# EasyEDA Pro project TTMT_ENTIRE_EASYEDA_PROJECT.epro, board PCB3_1
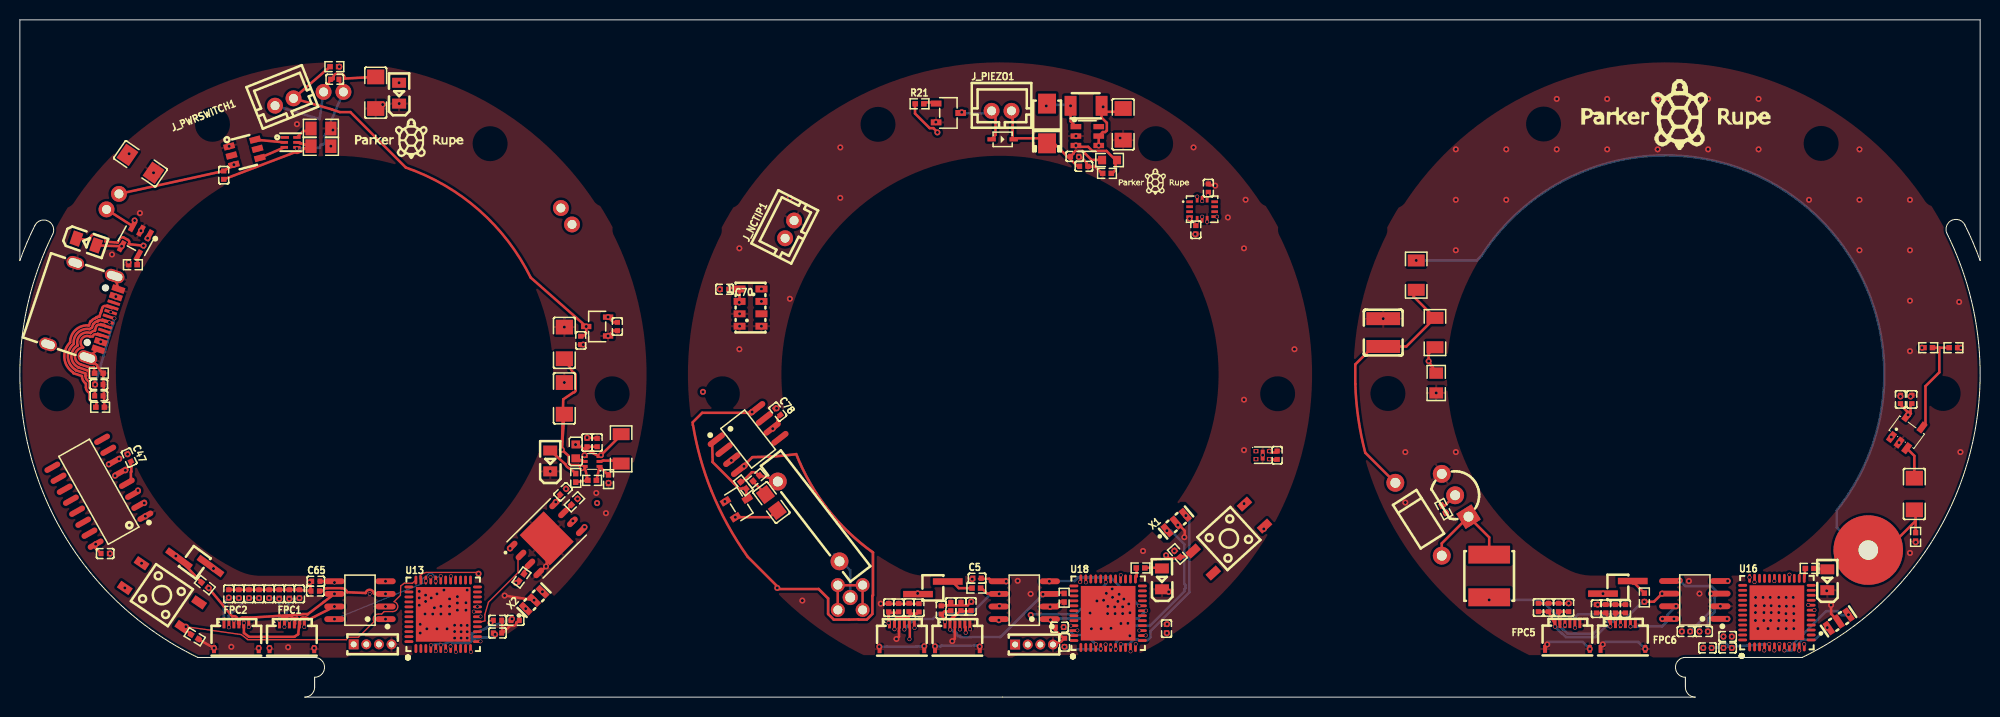
[diagram p18: board, top side]
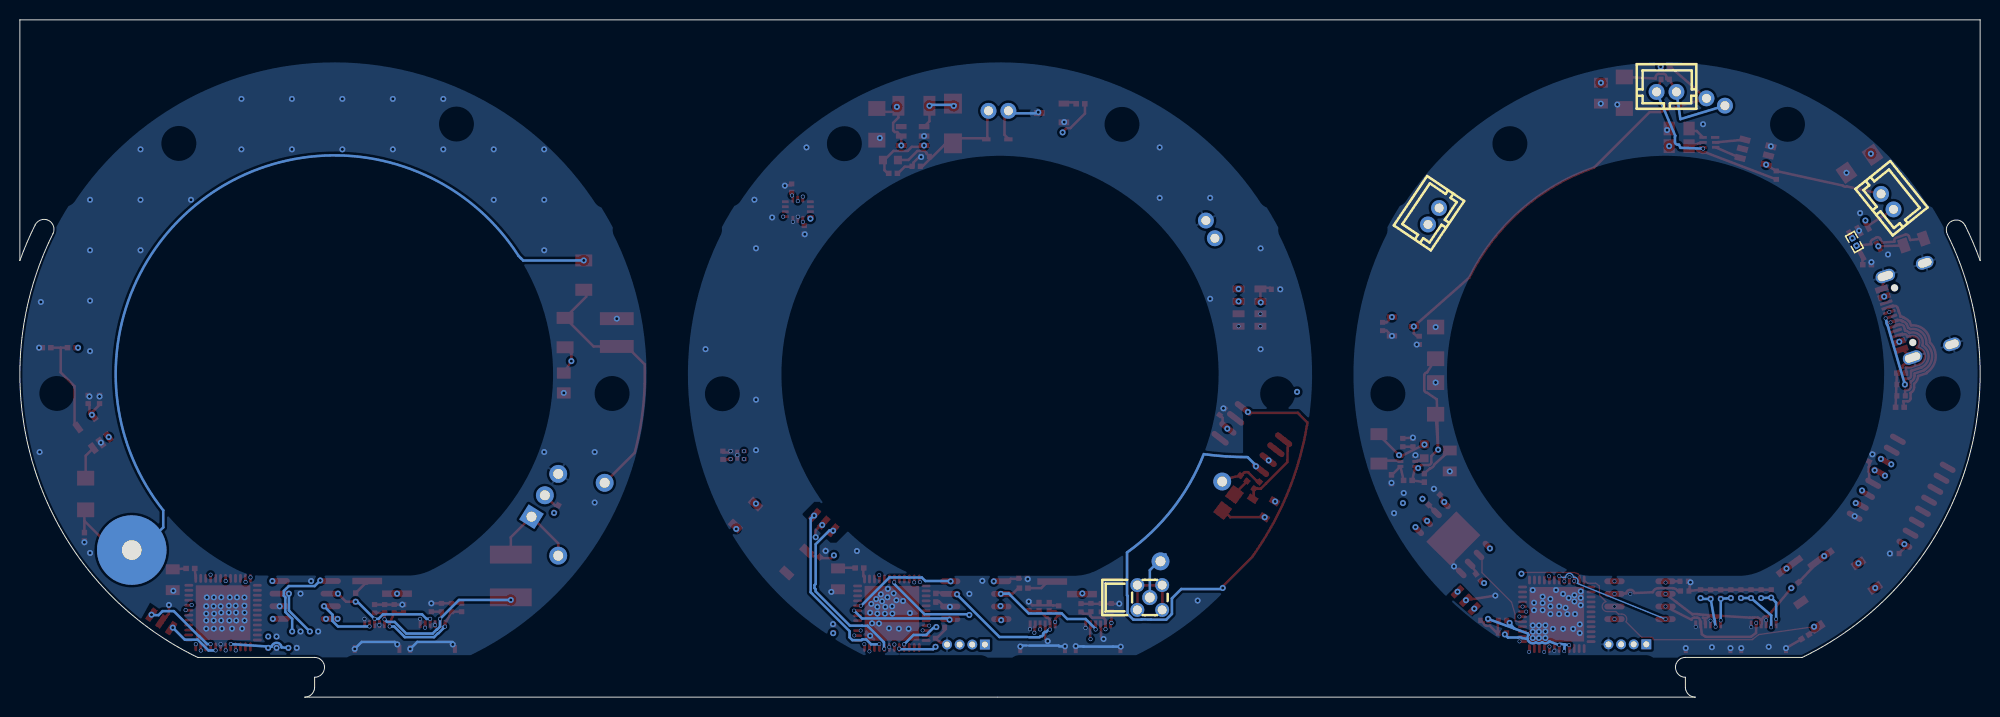
[diagram p19: board, bottom side, seen from below]

Outline 197.34 x 68.2 mm; copper layers: Top Layer, GND, 3V3, Inner3, Inner4, Bottom Layer. Coordinates in mm from the lower left corner of the outline.
Outline path: 0,68.2 197.34,68.2 197.34,43.96 arc(196.63,45.78) 195.81,47.55 arc(194.47,47.99) 194.02,46.65 arc(195.64,22.28) 179.44,4 167.67,4 arc(166.67,3) 167.67,2 167.67,1 arc(167.96,0.29) 168.67,0 28.67,0 arc(29.38,0.29) 29.67,1 29.67,2 arc(30.67,3) 29.67,4 17.91,4 arc(1.71,22.26) 3.3,46.61 arc(2.85,47.95) 1.51,47.5 arc(0.71,45.75) 0,43.96 0,68.2
Stack: Top Layer 0.035mm Outer layer thickness 1oz / Dielectric1 0.0994mm 3313 RC57% 4.2mil / GND 0.0152mm Inner layer thickness / Dielectric2 0.55mm 0.55mm H/H No copper / 3V3 0.0152mm Inner layer thickness / Dielectric3 0.1088mm 2116 RC54% 4.9mil / Inner3 0.0152mm Inner layer thickness / Dielectric4 0.55mm 0.55mm H/H No copper / Inner4 0.0152mm Inner layer thickness / Dielectric5 0.0994mm 3313 RC57% 4.2mil / Bottom Layer 0.035mm Outer layer thickness 1oz

## Design rules (mm)
template: Custom Config
spacing copperThickness1oz (default): track to track 0.102, other pairs 0.1 to 0.3
spacing copperThickness2oz: track to track 0.203, other pairs 0.152 to 0.3
track width copperThickness1oz (default): min 0.127, default 0.254, max 2.54
track width copperThickness2oz: min 0.203, default 0.254, max 2.54
differential pair differentialPair (default): width min 0.127, default 0.254, max 2.54; gap min 0.152, default 0.152
via viaSize (default): diameter min 0.1, default 0.61, max 10; hole min 0.05, default 0.305, max 6.3

## Placement (name value [footprint] x y rotation side)
C1  47uF  [C1111]  137.25 36.71 270 top
C2  100nF  [C1206]  54.81 35.67 270 top
C3  10uF  [C1206]  190.72 20.45 90 top
C4  10uF  [C0805]  75.66 19.6 306.7 top
C5  10uF  [C0402]  96.36 11.97 0 top
C6  10nF  [C0402]  7.95 31.48 180 top
C7  10uF  [C0402]  58.12 25.64 270 top
C8  100nF  [C0402]  90.51 8.99 270 top
C9  10uF  [C0402]  92.76 8.78 270 top
C10  10uF  [C0402]  93.72 9.13 270 top
C11  100nF  [C0402]  94.74 9.13 270 top
C12  100nF  [C0402]  95.76 9.14 90 top
C13  22uF  [C0402]  153.89 9.02 270 top
C14  470pF  [C0402]  154.91 9.02 270 top
C15  100pF  [C0402]  155.92 9.02 90 top
C16  100nF  [C0402]  158.72 8.9 90 top
C17  100nF  [C0402]  159.66 8.9 270 top
C18  100nF  [C0402]  161.64 8.9 270 top
C19  100nF  [C0402]  87.47 9.01 270 top
C20  10uF  [C0402]  88.47 9 90 top
C21  10uF  [C0402]  104.66 7.04 180 top
C22  100nF  [C0402]  105.17 5.51 90 top
C23  10uF  [C0402]  167.73 6.61 0 top
C24  100nF  [C0402]  169.51 6.61 180 top
C25  10uF  [C0402]  169.89 4.96 180 top
C26  100nF  [C0402]  171.92 4.96 180 top
C27  100nF  [C0402]  171.92 6.1 180 top
C38  4.7uF  [C1206]  35.82 60.86 90 top
C39  4.7uF  [C1206]  12.14 53.7 325.5 top
C40  100nF  [C0402]  20.52 52.56 270 top
C43  100nF  [C0402]  48.08 7.73 0 top
C44  100nF  [C0402]  48.08 6.46 0 top
C45  100nF  [C0402]  49.86 7.73 0 top
C46  100nF  [C0402]  152.87 9.02 90 top
C47  100nF  [C0402]  11 24.11 294.8 top
C50  100nF  [C0402]  8.59 14.46 0 top
C51  10nF  [C0402]  7.95 30.33 180 top
C52  100nF  [C0402]  56.47 35.92 90 top
C53  100nF  [C0402]  60.15 37.32 90 top
C54  22uF  [C1206]  111.07 57.68 90 top
C55  22uF  [C1206]  54.81 30.08 270 top
C56  1uF  [C0402]  57.1 25.64 270 top
C57  100nF  [C0402]  25.1 10.4 90 top
C58  100nF  [C0402]  28.15 10.4 90 top
C59  100nF  [C0402]  24.08 10.4 90 top
C60  100nF  [C0402]  21.03 10.4 90 top
C61  10uF  [C0402]  22.05 10.4 270 top
C62  10uF  [C0402]  23.06 10.4 270 top
C63  10uF  [C0402]  27.13 10.4 270 top
C64  10uF  [C0402]  26.11 10.4 270 top
C65  100nF  [C0402]  29.8 11.67 0 top
C66  100nF  [C0402]  29.74 10.68 180 top
C67  100nF  [C0402]  54.69 20.68 224.1 top
C68  100nF  [C0402]  160.62 8.9 90 top
C69  100nF  [C0402]  115.44 6.9 270 top
C70  100nF  [C0402]  70.94 41.07 180 top
C71  100nF  [C0402]  189.32 29.98 270 top
C72  10uF  [C0402]  190.47 29.98 270 top
C73  100nF  [C0402]  118.38 47.06 270 top
C74  100nF  [C0402]  119.65 51.26 90 top
C75  100nF  [C0402]  106.2 54.45 180 top
C76  10uF  [C0402]  107.11 53.45 180 top
C78  100nF  [C0402]  76.31 28.74 307.9 top
C79  100nF  [C0402]  126.57 24.36 270 top
C80  100nF  [C0402]  89.52 9.03 90 top
C_VBAT1  10uF  [C0402]  31.7 62.21 180 top
D1  BAV99  [SOT-23-3_L2.9-W1.3-P1.90-LS2.4-BR]  72.39 19.45 212.2 top
D2  BAV20WS-HE3-08  [SOD-323_L1.8-W1.3-LS2.7-RD]  98.94 56.17 180 top
D3  SS34  [SMA_L4.2-W2.7-LS5.0-RD]  103.41 57.76 90 top
D4  UF4007  [DO-41_BD2.4-L4.7-P8.70-D0.9-RD]  140.81 17.91 302.5 top
FPC1  HC-FPC-05-09-6RLTAG  [FPC-SMD_6P-P0.50_HC-FPC-05-09-6RLTAG]  27.38 6.08 180 top
FPC2  HC-FPC-05-09-6RLTAG  [FPC-SMD_6P-P0.50_HC-FPC-05-09-6RLTAG]  21.79 6.08 180 top
FPC3  HC-FPC-05-09-6RLTAG  [FPC-SMD_6P-P0.50_HC-FPC-05-09-6RLTAG]  88.79 6.08 180 top
FPC4  HC-FPC-05-09-6RLTAG  [FPC-SMD_6P-P0.50_HC-FPC-05-09-6RLTAG]  94.38 6.08 180 top
FPC5  HC-FPC-05-09-6RLTAG  [FPC-SMD_6P-P0.50_HC-FPC-05-09-6RLTAG]  155.79 6.1 180 top
FPC6  HC-FPC-05-09-6RLTAG  [FPC-SMD_6P-P0.50_HC-FPC-05-09-6RLTAG]  161.38 6.1 180 top
H1  M50-3630242  [HDR-SMD_2P-P1.27_M50-3630242]  91.92 11.01 90 top
H2  M50-3630242  [HDR-SMD_2P-P1.27_M50-3630242]  160.88 11.06 90 top
H3  M50-3630242  [HDR-SMD_2P-P1.27_M50-3630242]  17.6 13.57 233.8 top
J_BAT1  B2B-PH-K-S(LF)(SN)  [CONN-TH_B2B-PH-K-S]  55.03 48.42 124 bottom
J_BAT2  B2B-PH-K-S(LF)(SN)  [CONN-TH_B2B-PH-K-S]  9.35 49.89 231.2 bottom
J_BAT3  B2B-PH-K-S(LF)(SN)  [CONN-TH_B2B-PH-K-S]  31.57 60.94 180 bottom
J_NCTIP1  B2B-PH-K-S(LF)(SN)  [CONN-TH_B2B-PH-K-S]  77.49 47.1 63.1 top
J_PIEZO1  B2B-PH-K-S(LF)(SN)  [CONN-TH_B2B-PH-K-S]  98.83 59.04 0 top
J_PWRSWITCH1  B2B-PH-K-S(LF)(SN)  [CONN-TH_B2B-PH-K-S]  26.62 59.93 21.6 top
J_SWD1  PZ127V-11-04-0720  [HDR-TH_4P-P1.27-V-M]  35.51 5.32 0 top
J_SWD2  PZ127V-11-04-0720  [HDR-TH_4P-P1.27-V-M]  102.1 5.3 0 top
J_USB1  TYPE-C-31-M-12  [USB-C_SMD-TYPE-C-31-M-12_1]  6.55 38.84 251.5 top
L1  1uH  [IND-SMD_L3.2-W2.5]  107.34 59.54 0 top
L2  22uH  [L0603]  55.96 24.75 90 top
L3  1mH  [IND-SMD_L5.0-W5.0_FNR50XXS]  147.92 12.2 90 top
LED1  KT-0805G  [LED0805-R-RD]  114.98 11.91 90.3 top
LED2  KT-0805G  [LED0805-R-RD]  181.96 11.82 90 top
LED4  KT-0805G  [LED0805-R-RD]  38.18 60.81 90 top
LED5  KT-0805G  [LED0805-R-RD]  6.68 45.83 340.9 top
LED6  KT-0805G  [LED0805-R-RD]  53.39 23.78 90 top
Q1  BSS138LT1G  [SOT-23-3_L2.9-W1.6-P1.90-LS2.8-BR]  93.48 58.82 180 top
Q2  MPSA42  [TO-92-3_L4.8-W3.7-P2.54-R]  144.49 20.33 302 top
Q_BMS1  FS8205A  [SOT-23-6_L2.9-W1.6-P0.95-LS2.8-BR]  22.61 54.88 194.5 top
R1  10kΩ  [R1206]  140.58 42.49 90 top
R2  200MΩ  [RES-TH_L14.7-W2.54-P10.2-D0.8]  79.41 17.69 127.7 top
R3  1MΩ  [R0402]  74.14 22.03 220.4 top
R4  120Ω  [R0402]  192.12 35.19 0 top
R5  1kΩ  [R0402]  194.66 35.19 0 top
R6  5.1kΩ  [R0402]  8.08 29.19 180 top
R7  100Ω  [R0402]  55.83 19.67 44.3 top
R8  1kΩ  [R0402]  31.66 63.49 180 top
R9  2kΩ  [R0402]  11.38 43.54 0 top
R10  330Ω  [R0805]  30.3 55.48 0 top
R11  2.2kΩ  [R0805]  30.3 57.26 0 top
R12  560kΩ  [R0402]  55.96 22.08 270 top
R13  5.1kΩ  [R0402]  7.95 32.62 180 top
R14  10kΩ  [R0402]  17.6 6.08 148.8 top
R15  10kΩ  [R0402]  59.26 21.95 90 top
R16  100kΩ  [R1206]  60.53 25 270 top
R17  1kΩ  [R1206]  142.46 36.71 90 top
R18  120Ω  [R0402]  96.29 10.98 180 top
R19  120Ω  [R0402]  18.62 11.28 141.7 top
R20  10kΩ  [R0402]  143.35 18.93 298.4 top
R21  10kΩ  [R0402]  90.57 59.74 0 top
R22  200Ω  [R0603]  109.7 54.08 180 top
R23  10kΩ  [R0402]  109.44 52.74 0 top
R24  10kΩ  [R0402]  116.54 14.42 311.8 top
R25  51kΩ  [R0805]  142.59 31.63 90 top
R26  10MΩ  [R0402]  72.83 21.33 128.9 top
R27  10kΩ  [R0402]  50.5 12.05 54.5 top
R28  10MΩ  [R0402]  112.82 13.01 0 top
R29  1kΩ  [R0402]  180.18 12.96 180 top
R30  120Ω  [R0402]  190.85 16.14 90 top
R31  100kΩ  [R0402]  105.13 10.01 90 top
R32  100kΩ  [R0402]  163.54 10.04 90 top
R_FB1  73.2kΩ  [R0402]  57.61 21.83 0 top
R_STAT1  470Ω  [R0402]  12.65 45.83 60.9 bottom
SW1  SH-4.5x4.5x4.0H-TP  [SW-SMD_4P-SH-4.5X4.5X4.0H-TP]  14.3 10.27 325.8 top
SW3  SH-4.5x4.5x4.0H-TP  [SW-SMD_4P-SH-4.5X4.5X4.0H-TP]  121.71 15.97 222.5 top
U1  LMP7721MAX/NOPB  [SOIC-8_L4.9-W3.9-P1.27-LS6.0-BL]  73.31 25.99 307.9 top
U2  MCP73831T-2ACI/OT  [SOT-23-5_L3.0-W1.7-P0.95-LS2.8-BL]  11.63 45.96 151.2 top
U3  TCAN1042HVDRQ1  [SOT-23-5_L3.0-W1.7-P0.95-LS2.8-BR]  189.96 26.68 233.6 top
U4  XC6206P332MR  [SOT-23-3_L3.0-W1.7-P0.95-LS2.9-BR]  58.12 37.32 0 top
U5  LMP7721MAX/NOPB  [SOIC-8_L4.9-W3.9-P1.27-LS6.0-BL]  101.11 9.76 90 top
U6  BQ29700DSER  [WSON-6_L1.5-W1.5-P0.50-TL]  27.26 55.86 0 top
U7  TCAN1042HVDRQ1  [SOIC-8_L4.9-W3.9-P1.27-LS6.0-BL]  168.62 9.79 90 top
U8  TCAN1042HVDRQ1  [SOIC-8_L4.9-W3.9-P1.27-LS6.0-BL]  34.24 9.76 90 top
U9  TPS61023DRLR  [SOT-563_L1.6-W1.2-P0.50-LS1.6-BR]  57.61 23.73 0 top
U10  6GHz  [SBM21]  186.08 14.81 0 top
U11  LSM6DSO32TR  [LGA-14_L3.0-W2.5-P0.50-TL]  119.02 49.13 0 top
U12  W25Q128JVPIM TR  [WSON-8_L6.0-W5.0-P1.27-BL-EP]  53.04 15.98 314.7 top
U13  STM32G0B1CEU6  [UFQFPN-48_L7.0-W7.0-P0.50-BL-EP]  42.62 8.34 0 top
U14  MS560702BA03-50  [SENSOR-SMD_MS560702BA03-50]  73.56 39.22 0 top
U15  SHT40-AD1F-R2(TOKMAS)  [DFN-4_L1.5-W1.5-P0.80-TL-EP]  125.12 24.37 0 top
U16  TCAN1042HVDRQ1  [UFQFPN-48_L7.0-W7.0-P0.50-BL-EP]  176.89 8.51 0 top
U17  MT3608  [SOT-23-6_L2.9-W1.6-P0.95-LS2.8-BL]  107.46 56.5 270 top
U18  TLV3201AIDBVR  [UFQFPN-48_L7.0-W7.0-P0.50-BL-EP]  109.56 8.45 0 top
U19  SBM-21  [MMCX-TH_DL-MMCX-KWE]  83.59 10.03 270 bottom
U_USB1  CH340C  [SOP-16_L10.0-W3.9-P1.27-LS6.0-BL]  7.95 20.68 119.4 top
X1  8MHz  [OSC-SMD_3P-L3.2-W1.3-P1.20-L]  116.4 17.58 40.2 top
X2  8MHz  [OSC-SMD_3P-L3.2-W1.3-P1.20-L]  51.77 9.76 45.3 top
X3  8MHz  [OSC-SMD_3P-L3.2-W1.3-P1.20-L]  183.1 7.63 34.2 top

## Footprints (pads in the part's own frame, mm; a bottom-side part is the same pattern mirrored in y, then rotated)
C0402
  rect 0.5x0.54 smd: 1(-0.42,0) 2(0.42,0)
C0805
  rect 1.41x1.35 smd: 1(-1,0) 2(1,0)
C1111
  rect 1.3x3.4 smd: 1(-1.4,0) 2(1.4,0)
C1206
  rect 1.485x1.728 smd: 1(-1.593,0) 2(1.593,0)
CONN-TH_B2B-PH-K-S
  round 1.6 hole 0.9: 1(1,0) 2(-1,0)
DFN-4_L1.5-W1.5-P0.80-TL-EP
  rect 0.505x0.42 smd: 1(-0.677,0.4) 2(-0.677,-0.4) 3(0.677,-0.4) 4(0.677,0.4)
  rect 0.4x1.1 smd: 5(0,0)
DO-41_BD2.4-L4.7-P8.70-D0.9-RD
  round 1.8 hole 1: 1(-4.35,0) 2(4.35,0)
FPC-SMD_6P-P0.50_HC-FPC-05-09-6RLTAG
  rect 0.3x0.8 smd: 1(1.25,-1.25) 2(0.75,-1.25) 3(0.25,-1.25) 4(-0.25,-1.25) 5(-0.75,-1.25) 6(-1.25,-1.25)
  rect 0.4x0.8 smd: 7(-2.25,1.25) 8(2.25,1.25)
HDR-SMD_2P-P1.27_M50-3630242
  rect 0.65x3 smd: 1(-0.635,1.5) 2(0.635,-1.5)
HDR-TH_4P-P1.27-V-M
  rect 1x1 hole 0.6: 1(-1.905,0)
  round 1 hole 0.6: 2(-0.635,0) 3(0.635,0) 4(1.905,0)
IND-SMD_L3.2-W2.5
  rect 1.2x2 smd: 1(-1.562,0) 2(1.562,0)
IND-SMD_L5.0-W5.0_FNR50XXS
  rect 1.8x4.2 smd: 1(-2.15,0) 2(2.15,0)
L0603
  rect 0.8x0.864 smd: 1(-0.7,0) 2(0.7,0)
LED0805-R-RD
  rect 1x1.399 smd: 1(1.05,0) 2(-1.05,0)
LGA-14_L3.0-W2.5-P0.50-TL
  rect 0.675x0.28 smd: 1(-1.262,0.75) 2(-1.262,0.25) 3(-1.262,-0.25) 4(-1.262,-0.75) 8(1.262,-0.75) 9(1.262,-0.25) 10(1.262,0.25) 11(1.262,0.75)
  rect 0.28x0.675 smd: 5(-0.5,-1.012) 6(0,-1.012) 7(0.5,-1.012) 12(0.5,1.012) 13(0,1.012) 14(-0.5,1.012)
MMCX-TH_DL-MMCX-KWE
  round 1.524 hole 1: 1(0,0)
  round 1.4 hole 0.9: 2(-1.25,1.25) 3(-1.25,-1.25) 4(1.25,-1.25) 5(1.25,1.25)
OSC-SMD_3P-L3.2-W1.3-P1.20-L
  rect 0.6x1.4 smd: 1(-1.199,0) 2(0,0) 3(1.199,0)
R0402
  rect 0.566x0.54 smd: 1(-0.433,0) 2(0.433,0)
R0603
  rect 0.806x0.864 smd: 1(-0.753,0) 2(0.753,0)
R0805
  rect 1.133x1.377 smd: 1(-1,0) 2(1,0)
R1206
  rect 1.208x1.701 smd: 1(-1.479,0) 2(1.479,0)
RES-TH_L14.7-W2.54-P10.2-D0.8
  round 1.8 hole 1: 1(-5.08,0) 2(5.08,0)
SBM21
  round 7 smd far side: 1(0,0)
  round 7 smd: 2(0,0)
SENSOR-SMD_MS560702BA03-50
  rect 1.2x0.7 smd: 1(-1.1,1.875) 2(-1.1,0.625) 3(-1.1,-0.625) 4(-1.1,-1.875) 5(1.1,-1.875) 6(1.1,-0.625) 7(1.1,0.625) 8(1.1,1.875)
SMA_L4.2-W2.7-LS5.0-RD
  rect 2x1.8 smd: 1(-2,0) 2(2,0)
SOD-323_L1.8-W1.3-LS2.7-RD
  rect 0.845x0.42 smd: 1(-1.11,0) 2(1.11,0)
SOIC-8_L4.9-W3.9-P1.27-LS6.0-BL
  oval 0.588x2.045 smd: 1(-1.905,-2.57) 2(-0.635,-2.57) 3(0.635,-2.57) 4(1.905,-2.57) 5(1.905,2.57) 6(0.635,2.57) 7(-0.635,2.57) 8(-1.905,2.57)
SOP-16_L10.0-W3.9-P1.27-LS6.0-BL
  oval 0.56x1.745 smd: 1(-4.445,-2.873) 2(-3.175,-2.873) 3(-1.905,-2.873) 4(-0.635,-2.873) 5(0.635,-2.873) 6(1.905,-2.873) 7(3.175,-2.873) 8(4.445,-2.873) 9(4.445,2.873) 10(3.175,2.873) 11(1.905,2.873) 12(0.635,2.873) 13(-0.635,2.873) 14(-1.905,2.873) 15(-3.175,2.873) 16(-4.445,2.873)
SOT-23-3_L2.9-W1.3-P1.90-LS2.4-BR
  rect 1x0.65 smd: 1(1,-0.95) 2(1,0.95) 3(-1,0)
SOT-23-3_L2.9-W1.6-P1.90-LS2.8-BR
  rect 1.07x0.6 smd: 1(1.235,-0.95) 2(1.235,0.95) 3(-1.235,0)
SOT-23-3_L3.0-W1.7-P0.95-LS2.9-BR
  rect 1.038x0.532 smd: 1(1.101,-0.95) 2(1.101,0.95) 3(-1.101,0)
SOT-23-5_L3.0-W1.7-P0.95-LS2.8-BL
  rect 0.49x1.157 smd: 1(-0.95,-1.154) 2(0,-1.153) 3(0.95,-1.153)
  rect 0.49x1.175 smd: 4(0.95,1.154) 5(-0.95,1.153)
SOT-23-5_L3.0-W1.7-P0.95-LS2.8-BR
  rect 1.1x0.6 smd: 1(1.3,-0.95) 2(1.3,0) 3(1.3,0.95) 4(-1.3,0.95) 5(-1.3,-0.95)
SOT-23-6_L2.9-W1.6-P0.95-LS2.8-BL
  rect 0.532x1.072 smd: 1(-0.95,-1.149) 2(0,-1.149) 3(0.95,-1.149) 4(0.95,1.149) 5(0,1.149) 6(-0.95,1.149)
SOT-23-6_L2.9-W1.6-P0.95-LS2.8-BR
  rect 1.1x0.6 smd: 1(1.35,-0.95) 2(1.35,0) 3(1.35,0.95) 4(-1.35,0.95) 5(-1.35,0) 6(-1.35,-0.95)
SOT-563_L1.6-W1.2-P0.50-LS1.6-BR
  rect 0.6x0.3 smd: 1(0.75,-0.5) 2(0.75,0) 3(0.75,0.5) 4(-0.75,0.5) 5(-0.75,0) 6(-0.75,-0.5)
SW-SMD_4P-SH-4.5X4.5X4.0H-TP
  rect 1.4x0.8 smd: 1(-3.5,1.5) 2(3.5,1.5) 3(-3.5,-1.5) 4(3.5,-1.5)
TO-92-3_L4.8-W3.7-P2.54-R
  rect 1.8x1.8 hole 1: 1(2.54,0)
  round 1.8 hole 1: 2(0,0) 3(-2.54,0)
UFQFPN-48_L7.0-W7.0-P0.50-BL-EP
  oval 0.28x0.9 smd: 1(-2.751,-3.45) 2(-2.251,-3.45) 3(-1.75,-3.45) 4(-1.25,-3.45) 5(-0.749,-3.45) 6(-0.249,-3.45) 7(0.249,-3.45) 8(0.75,-3.45) 9(1.25,-3.45) 10(1.75,-3.45) 11(2.251,-3.45) 12(2.751,-3.45) 25(2.751,3.449) 26(2.251,3.449) 27(1.75,3.449) 28(1.25,3.449) 29(0.75,3.449) 30(0.249,3.449) 31(-0.249,3.449) 32(-0.749,3.449) 33(-1.25,3.449) 34(-1.75,3.449) 35(-2.251,3.449) 36(-2.751,3.449)
  oval 0.9x0.28 smd: 13(3.45,-2.751) 14(3.45,-2.251) 15(3.45,-1.75) 16(3.45,-1.25) 17(3.45,-0.75) 18(3.45,-0.249) 19(3.45,0.249) 20(3.45,0.749) 21(3.45,1.25) 22(3.45,1.75) 23(3.45,2.251) 24(3.45,2.751) 37(-3.449,2.751) 38(-3.449,2.251) 39(-3.449,1.75) 40(-3.449,1.25) 41(-3.449,0.749) 42(-3.449,0.249) 43(-3.449,-0.249) 44(-3.449,-0.75) 45(-3.449,-1.25) 46(-3.449,-1.75) 47(-3.449,-2.251) 48(-3.449,-2.751)
  rect 5.5x5.5 smd: 49(0,0)
USB-C_SMD-TYPE-C-31-M-12_1
  oval 1.2x2 hole 0.8x1.6: 1(4.325,1.706) 4(-4.325,1.706)
  oval 1.2x1.8 hole 0.8x1.4: 2(4.325,-2.474) 3(-4.325,-2.474)
  custom 0.6x1.3 smd: A1B12(-3.2,2.474) A4B9(-2.4,2.474) B1A12(3.2,2.474) B4A9(2.401,2.474)
  rect 0.3x1.3 smd: A5(-1.25,2.474) A6(-0.25,2.474) A7(0.25,2.474) A8(1.25,2.474) B5(1.75,2.474) B6(0.75,2.474) B7(-0.75,2.474) B8(-1.75,2.474)
WSON-6_L1.5-W1.5-P0.50-TL
  rect 0.84x0.28 smd: 1(-0.581,0.5)
  rect 0.75x0.28 smd: 2(-0.636,0) 3(-0.636,-0.5) 4(0.636,-0.5) 5(0.636,0) 6(0.636,0.5)
WSON-8_L6.0-W5.0-P1.27-BL-EP
  oval 0.581x1.276 smd: 1(-1.905,-3.013) 2(-0.635,-3.012) 3(0.635,-3.013) 4(1.905,-3.013) 5(1.905,3.013) 6(0.635,3.012) 7(-0.635,3.013) 8(-1.905,3.013)
  rect 4.3x3.4 smd: 9(0,0)

## Nets
3V3: C5.2 C9.2 C10.2 C13.2 C16.1 C17.2 C19.2 C20.1 C21.1 C22.1 C24.1 C25.1 C26.1 C27.1 C43.1 C44.1 C45.1 C46.1 C50.1 C53.2 C57.1 C60.1 C61.2 C64.2 C65.2 C67.2 C69.2 C70.1 C71.2 C72.2 C73.1 C74.1 C78.2 C79.2 D1.1 FPC1.1 FPC2.1 FPC3.1 FPC4.1 FPC5.1 FPC6.1 J_SWD1.1 J_SWD2.1 R4.1 R7.2 R27.1 SW1.1 SW3.1 U1.6 U3.5 U4.2 U5.5 U7.5 U8.5 U11.5 U11.8 U11.12 U12.8 U13.4 U13.5 U13.6 U14.1 U14.2 U15.3 U16.4 U16.5 U16.6 U18.4 U18.5 U18.6 U_USB1.16
+5V: C2.2 C8.2 C11.2 C12.1 C14.2 C15.1 C18.2 C23.2 C54.2 C55.2 C66.1 C68.1 C80.1 FPC3.2 FPC4.2 FPC5.2 FPC6.2 L1.2 L3.1 R12.2 R31.2 R_FB1.1 U5.3 U7.3 U8.3 U9.6 U17.4 U17.5
+12V: C75.2 C76.2 D2.1 D3.1 J_PIEZO1.1 R22.2
+400V: C1.2 D4.1 R1.1 R17.2
GND: C1.1 C2.1 C4.2 C5.1 C6.1 C7.1 C8.1 C9.1 C10.1 C11.1 C12.2 C13.1 C14.1 C15.2 C16.2 C17.1 C18.1 C19.1 C20.2 C21.2 C22.2 C23.1 C24.2 C25.2 C26.2 C27.2 C38.1 C39.2 C43.2 C44.2 C45.2 C46.2 C47.1 C50.2 C51.1 C52.1 C53.1 C54.1 C55.1 C56.1 C57.2 C58.2 C59.2 C60.2 C61.1 C62.1 C63.1 C64.1 C65.1 C66.2 C67.1 C68.2 C69.1 C70.2 C71.1 C72.1 C73.2 C74.2 C75.1 C76.1 C78.1 C79.1 C80.2 D1.2 FPC1.3 FPC1.6 FPC1.7 FPC1.8 FPC2.3 FPC2.6 FPC2.7 FPC2.8 FPC3.3 FPC3.6 FPC3.7 FPC3.8 FPC4.3 FPC4.6 FPC4.7 FPC4.8 FPC5.3 FPC5.6 FPC5.7 FPC5.8 FPC6.3 FPC6.6 FPC6.7 FPC6.8 J_NCTIP1.1 J_SWD1.4 J_SWD2.4 J_USB1.1 J_USB1.2 J_USB1.3 J_USB1.4 J_USB1.A1B12 J_USB1.B1A12 LED1.2 LED2.2 LED4.2 LED6.2 Q1.2 Q2.3 Q_BMS1.1 R5.2 R6.1 R9.1 R11.2 R13.1 R14.1 R15.1 R23.1 R24.1 R25.1 R30.1 R31.1 U1.3 U2.2 U3.2 U4.1 U5.2 U7.2 U8.2 U9.4 U11.6 U11.7 U12.4 U12.9 U13.7 U13.49 U14.3 U14.4 U14.5 U15.4 U15.5 U16.7 U16.49 U17.2 U18.7 U18.49 U19.2 U19.3 U19.4 U19.5 U_USB1.1 X1.2 X2.2 X3.2
VBAT: C7.2 C52.2 C56.2 C58.1 C59.1 C62.2 C63.2 FPC1.2 FPC2.2 J_PWRSWITCH1.1 L2.2 R8.2 R16.1 U4.3 U9.3
VBUS_5V: C39.1 J_USB1.A4B9 J_USB1.B4A9 LED5.1 U2.4
ACCEL1_INT: U18.14
ACCEL2_INT: U11.4 U18.15
BOOT0: R14.2 R24.2 SW1.4 SW3.4 U13.36 U16.36 U18.36
CANFD_RX: U5.4 U7.4 U8.4 U13.20 U16.20 U18.20
CANFD_TX: U5.1 U7.1 U8.1 U13.19 U16.19 U18.19
CANH: FPC1.5 FPC2.5 FPC3.5 FPC4.5 FPC5.5 FPC6.5 H1.1 H2.1 H3.1 U5.7 U7.7 U8.7
CANL: FPC1.4 FPC2.4 FPC3.4 FPC4.4 FPC5.4 FPC6.4 R18.1 R19.1 R32.1 U5.6 U7.6 U8.6
CH340C_RX: U13.29 U_USB1.3
CH340C_TX: U13.32 U_USB1.2
CHARGEOUT: U1.4 U1.8 U18.11
FLASH_CS: U12.1 U13.13
GEIGER_OUT: U3.1 U16.11
HV_MONITOR: R17.1 R25.2 U16.12
HV_PWM: R20.2 U16.28
I2C_SCL: U11.13 U14.8 U15.2 U18.45
I2C_SDA: U11.14 U14.7 U15.1 U18.46
NCTHERM_ADC: J_NCTIP1.2 U18.12
OSC_IN: U13.8 U16.8 U18.8 X1.1 X2.1 X3.1
OSC_OUT: U13.9 U16.9 U18.9 X1.3 X2.3 X3.3
PIEZOCTRL: R21.1 U18.28
SPI1_MISO: U12.2 U13.17
SPI1_MOSI: U12.5 U13.18
SPI1_SCK: U12.6 U13.12
STB: U5.8 U7.8 U8.8 U13.31 U16.31 U18.31
SWD_CLK: J_SWD1.3 J_SWD2.3 SW1.3 SW3.3
SWD_IO: J_SWD1.2 J_SWD2.2 U13.35 U16.35 U18.35
U_USB_D+: C6.2 J_USB1.A6 J_USB1.B6 U13.34 U_USB1.5
U_USB_D-: C51.2 J_USB1.A7 J_USB1.B7 U13.33 U_USB1.6
$1N507: U16.45
$1N509: U16.46
$1N887: C40.1 C_VBAT1.1 J_BAT1.2 J_BAT2.2 J_BAT3.2 Q_BMS1.3 U6.4
$1N890: Q_BMS1.6 U6.2
$1N891: C40.2 R10.1 U6.5
$1N894: LED5.2 R_STAT1.1
$1N895: R_STAT1.2 U2.1
$1N897: R9.2 U2.5
$1N898: Q_BMS1.4 U6.3
$1N900: C38.2 C_VBAT1.2 J_BAT1.1 J_BAT2.1 J_BAT3.1 J_PWRSWITCH1.2 R10.2 U2.3
$1N2732: H2.2 R32.2
$1N2784: D4.2 L3.2 Q2.1
$1N3117: C3.2 U3.3
$1N3156: J_USB1.B5 R13.2
$1N3842: Q2.2 R20.1
$1N4040: R4.2 R5.1 U3.4
$1N4044: C3.1 R30.2 U10.2
$1N4167: R1.2 U10.1
$1N5814: R2.2 R3.1 R26.2
$1N5980: D1.3 R26.1 U1.1
$1N6241: C4.1 R3.2
$1N6389: R2.1 U19.1
$1N8915: R15.2 R_FB1.2 U9.1
$1N8918: R16.2 U9.2
$1N8921: L2.1 U9.5
$1N8925: LED6.1 R12.1
$1N9534: LED2.1 R29.1
$1N9861: D3.2 L1.1 U17.1
$1N9877: R22.1 R23.2 U17.3
$1N10012: D2.2 J_PIEZO1.2 Q1.3
$1N11861: R29.2 U16.25
$1N15938: H1.2 R18.2
$1N19964: LED4.1 R8.1
$1N20428: LED1.1 R28.2
$1N20714: Q1.1 R21.2
$1N22151: R11.1 U6.6
$1N22590: C47.2 U_USB1.4
$1N22735: J_USB1.A5 R6.2
$1N26596: R28.1 U18.25
$1N28064: H3.2 R19.2
$1N32733: R27.2 U12.3
$1N32803: R7.1 U12.7

Pads without a net: J_USB1 A8 B8; Q_BMS1 2 5; SW1 2; SW3 2; U1 2 5 7; U6 1; U11 1 2 3 9 10 11; U13 1 2 3 10 11 14 15 16 21 22 23 24 25 26 27 28 30 37 38 39 40 41 42 43 44 45 46 47 48; U14 6; U16 1 2 3 10 13 14 15 16 17 18 21 22 23 24 26 27 29 30 32 33 34 37 38 39 40 41 42 43 44 47 48; U17 6; U18 1 2 3 10 13 16 17 18 21 22 23 24 26 27 29 30 32 33 34 37 38 39 40 41 42 43 44 47 48; U_USB1 7 8 9 10 11 12 13 14 15

## Via types
v1: diameter 0.61, hole 0.305, Top Layer to Bottom Layer, 326 vias
v2: diameter 0.381, hole 0.305, Top Layer to Bottom Layer, 52 vias
v3: diameter 0.406, hole 0.305, Top Layer to Bottom Layer, 55 vias

## Routing (per net, layer and track width the routed paths; a pad name or vN(x,y) marks a point on that pad's centre or on a via; arc(x,y) is an arc through that point)
3V3: length 96.6
  Top Layer w0.254: U3.5 190.34,28.66 190.34,29.43 ; U14.1 U14.2 ; v1(190.09,28.43) 190.09,28.66 189.32,29.43 ; 71.93,41.21 71.43,41.21 71.29,41.07 ; 97.83,11.69 97.6,11.91 96.57,11.91 ; 93.09,7.59 93.09,7.92 92.65,8.35 ; C46.1 C13.2 FPC5.1 ; v1(59.22,38.27) 59.75,37.74 C53.2 ; 87.54,8.46 87.45,8.38 v3(87.45,7.47) 87.54,7.38 87.54,7.25 ; C50.1 7.63,15 v1(7.63,15.4) ; 93.76,8.65 93.1,8.65 92.82,8.37 ; C67.2 U12.8 ; 30.09,11.67 U8.5 ; 76.26,27.48 76.26,28.13 76.55,28.42 ; 125.95,23.95 126.21,23.95 126.35,23.81 ; C16.1 C17.2 FPC6.1 ; 87.49,8.49 88.38,8.49 88.4,8.52
  Inner3 w0.254: v3(176.62,4.71) v1(172.34,6.1) ; 115.39,6.52 114.16,5.29 113.02,5.29 112.52,5.79 112.14,5.79 111.88,5.53 111.28,5.53 111.01,5.79 109.94,5.79 109.45,5.3 v3(109.31,5.3) ; v1(172.34,4.96) v3(175.61,4.71)
  Inner4 w0.254: 68.89,24.1 68.89,30.62 v1(68.77,30.74) ; 70.84,19.69 70.61,19.92 arc(70.51,20.18) 70.42,20.44 arc(70.42,20.52) 70.4,20.6 arc(70.05,21.45) 69.67,22.29 arc(69.26,23.19) 68.89,24.1
  Bottom Layer w0.254: v2(41.87,4.62) 41.82,5.3 ; 41.82,5.3 42.35,5.38 ; 41.82,5.3 v2(41.37,5.23) ; 108.33,5.31 107.38,6.26 106.1,6.26 105.4,6.96 105.09,6.96 ; 45.56,5.86 46.12,5.94 arc(46.31,6.03) 46.53,6 47.54,6 v1(47.85,6.32) ; 45.56,5.86 arc(45.55,6.07) 45.46,6.27 arc(45.51,6.34) 45.54,6.41 46.91,6.91 ; 45.56,5.86 arc(45.24,5.46) 44.73,5.52 arc(44.41,5.42) 44.09,5.53 arc(43.76,5.42) 43.43,5.54 arc(43.39,5.57) 43.36,5.61 v2(42.37,5.24) ; 46.91,6.91 v1(49.55,7.88) ; 46.91,6.91 v1(47.37,7.48) ; v2(26.11,7.73) v1(26.11,9.9) v1(25.1,9.98) ; v2(20.54,7.86) 20.54,9.53 v1(21.03,10.02) v1(22.05,9.98) ; v1(170.31,4.96) 171,5.01 arc(171.47,5.47) 172,5.07 v3(176.11,5.34) ; v1(169.93,6.61) 169.93,7.89 170.61,8.57 170.61,10.06 170.77,10.21 170.77,10.69 170.27,11.18 167.66,11.18 v1(167.1,11.75) ; 105.2,5.03 105.41,4.82 108.81,4.82 ; v3(160.11,7.12) 159.66,7.12 158.58,6.04 155.65,6.04 155.25,6.44 155.2,6.44 154.69,6.96 154.69,7.1 v3(154.54,7.1)
  vias: v1(12.25,13.48) v1(49.94,11.49) v1(53.95,19.65) v1(56.14,19.97) v1(58.11,19.54) v1(70.97,19.7) v1(72.42,39.74) v1(75.79,27.03) v1(99.3,11.66) v1(105.08,7.06) v1(105.16,5.07) v1(115.47,6.44) v1(125.23,16.94) v1(191.49,35.19) v2(31.67,11.54) v3(93.13,7.58) v3(108.33,5.32) v3(108.83,4.88) v3(118.51,47.86) v3(119.61,50.51) v3(120.51,48.38) v3(125.79,23.97)
+5V: length 219.4
  Top Layer w0.254: C66.1 30.44,10.67 arc(30.65,10.89) 30.94,10.97 32.4,10.97 arc(32.74,10.86) 32.95,10.56 34.81,10.48 arc(35.24,10.81) 35.63,10.45 v2(36.81,10.4) ; 94.62,8.64 93.98,8.01 93.87,8.01 93.65,7.79 93.65,7.61 ; C15.1 C14.2 FPC5.2 ; v1(108.61,55.55) U17.5 109.02,56.9 109.26,56.9 109.43,57.07 109.43,57.83 108.9,58.36 L1.2 ; 94.8,8.65 95.8,8.65 95.82,8.67 ; v1(54.56,24.92) 54.7,29.99 55.68,30.65 arc(55.88,30.73) 55.96,30.93 55.96,32.42 arc(55.88,32.61) 55.68,32.69 C2.2 ; v1(54.56,24.92) 55.25,24.29 55.25,23.65 arc(55.33,23.45) 55.53,23.37 56.24,23.37 v1(56.58,23.06) ; v1(54.56,24.92) C55.2 ; 110.95,59.32 110.56,58.94 109.17,58.94 ; 105.08,10.53 104.31,10.53 104.21,10.43 ; 90.4,8.52 90.29,8.41 89.59,8.41 ; 55.96,21.65 R_FB1.1 U9.6 ; C18.2 C68.1 FPC6.2 ; 89.58,8.48 89.58,8.19 89.41,8.01 88.28,8.01 88.07,7.8 88.07,7.46
  Inner3 w0.254: 88.03,6.8 88.72,6.3 93.19,6.28 93.63,6.77
  Inner4 w0.127: 43.24,11.82 42.45,11.49 arc(42.35,11.46) 42.26,11.41 42.05,11.32 arc(42.01,11.31) 41.97,11.29 40.73,11.32 arc(40.72,11.33) 40.71,11.33 40.71,11.35 39.57,11.77 39.54,11.8 39.38,11.8 39.36,11.81 39.35,11.8 38.53,11.8 v2(36.81,10.4) ; v1(54.56,24.92) 50.94,21.96 arc(48.25,18.1) 44.81,14.9 43.8,12.15 arc(43.79,12.13) 43.79,12.11 arc(43.79,12.1) 43.79,12.1 arc(43.67,11.89) 43.45,11.78 arc(43.35,11.78) 43.26,11.79
  Inner4 w0.254: 109.13,59.52 110.39,60.78 110.39,61.29 ; 88.07,6.86 85.21,6.86 arc(84.73,6.59) 84.24,6.86 81.45,6.86 arc(79.81,8.04) 78.25,9.32 77.78,9.8 arc(77.76,9.82) 77.74,9.83 arc(77.71,9.85) 77.69,9.88 arc(77.61,9.96) 77.5,10.01 76.98,10.53 arc(76.93,10.57) 76.88,10.6 arc(76.83,10.66) 76.77,10.72 arc(76.58,11.48) 75.8,11.37 74.63,12.54 arc(72.73,15.09) 71.09,17.81 arc(70.85,18.44) 70.62,19.08 arc(70.56,19.27) 70.5,19.46 ; v1(170.26,10.42) 170.02,10.42 166.26,6.66 161.09,6.66 160.7,7.06 160.7,7.78 v3(160.64,7.84) ; 110.37,61.37 arc(109.92,61.6) 109.46,61.83 arc(98.2,63.75) 87,61.49 arc(87,61.49) 86.99,61.48 arc(75.81,52.77) 68.54,40.61 arc(68.46,40.4) 68.39,40.2 arc(67.43,32.08) 68.6,23.99 arc(68.98,23.07) 69.39,22.16 arc(69.77,21.33) 70.12,20.49 ; 70.45,19.49 arc(70.26,19.98) 70.09,20.46
  Bottom Layer w0.254: 95.93,6.06 98.73,6.06 103,10.33 ; v1(170.26,10.42) 170.26,8.72 v1(168.15,6.61) ; 94.63,6.14 94.44,6.14 94.33,6.26 94.33,6.4 94.16,6.57 94.02,6.57 93.82,6.76 ; v1(147.92,9.79) 153.14,9.79 v3(155.04,7.88) 155.04,7.1 155.35,6.79 155.4,6.79 155.79,6.4 158.44,6.4 159.61,7.57 160.37,7.57 v3(160.64,7.84) ; 95.76,6.03 94.67,6.03
  vias: v1(103,10.35) v1(109.06,59.44) v3(88.05,6.84) v3(93.65,6.8)
+12V: length 13.3
  Top Layer w0.254: 103.58,55.63 104.25,55.63 105.62,54.26 ; 108.85,54.09 107.89,54.09 106.98,55 106.25,55 106.09,54.83 106.09,54.76 105.81,54.48 ; 105.72,54.19 106.54,53.37 106.67,53.37 ; 103.4,55.9 103.02,56.28 100.22,56.28 ; 99.99,56.3 99.95,56.34 99.95,58.7
+400V: length 26.9
  Top Layer w0.254: D4.1 135.44,24.61 arc(134.75,28.05) 134.44,31.55 134.44,33.5 136.25,35.31 C1.2 139.58,35.31 R17.2 140.32,40.33 140.32,41.01
GND: length 109.5
  Top Layer w0.254: 88.33,5.91 88.5,6.08 88.5,6.65 88.5,6.65 88.5,6.96 88.58,7.04 ; C45.2 49.97,7.5 49.97,7.46 arc(49.89,7.26) 49.69,7.18 49.36,7.18 48.56,6.38 48.56,7.67 C43.2 ; 119.69,51.54 120.17,51.54 120.2,51.57 ; v1(155.92,9.44) C14.1 C13.1 C46.2 ; 17.97,5.84 v1(19.54,4.93) ; 104.35,5.49 104.65,5.49 104.78,5.62 104.86,5.62 105.09,5.86 ; J_USB1.A1B12 J_USB1.4 ; 94.12,7.03 94.12,5.89 v1(93.87,5.64) ; C53.1 59.75,36.9 v1(59.22,36.37) ; 105.09,9.63 104.81,9.63 104.31,9.14 ; X3.2 182.34,8.39 v1(182.34,9.28) ; 51.99,12.22 52.37,12.6 52.41,12.6 v1(52.97,13.16) 53.04,13.23 53.04,16.75 ; 104.19,6.93 104.19,6.79 105.1,5.88 ; 107.38,53.35 107.38,53.82 106.85,54.36 ; R6.1 R13.1 8.08,32.93 arc(8,33.09) 7.84,33.17 7.81,33.2 7.78,33.43 7.55,33.61 7.41,33.59 6.8,34.2 J_USB1.B1A12 ; C60.2 C61.1 C62.1 C59.2 C57.2 C64.1 C63.1 C58.2 C66.2 v1(29.16,11.56) ; v1(57.1,26.14) C7.1 ; 76.21,18.84 75.49,18.12 72.2,18.12 ; 86.81,9.4 90.5,9.4 90.54,9.37 ; 95.77,9.59 95.43,9.25 93.34,9.25 93.33,9.23 92.81,9.23 ; v1(158.84,9.32) C68.2 C18.1 ; 84.84,8.76 84.84,11.26 82.34,11.26 82.34,8.76 ; v1(48.8,10.23) v1(51.77,9.76) ; 126.57,24.64 125.99,24.64 125.87,24.75 ; 108.9,52.77 108.26,53.41 107.53,53.41 ; 116.65,17.37 117.27,16.76 117.27,16.15
  Inner3 w0.254: 78.76,9.66 78.76,11.42 72.15,18.03 ; 86.56,9.3 86.28,9.03 85,9.03 ; 76.13,29.06 71.69,24.62 71.69,23.82
  Bottom Layer w0.254: v1(159.35,5.31) 159.6,5.56 162.93,5.56 v1(163.63,4.85) ; 87.32,5.08 87.3,5.08 ; 87.3,5.08 90.27,5.09 90.28,5.1 ; 87.3,5.08 86.52,5.08 v1(86.52,5.08) ; v1(96.63,5.1) 96.52,5.2 95.97,5.2 ; 95.77,5.19 92.76,5.19 ; v1(91.05,5.13) 91.02,5.11 90.25,5.11 ; v1(92.13,5.12) 92.7,5.12 92.76,5.18 ; 153.76,5.56 157.34,5.56 v1(158.04,4.85)
  vias: v1(9.09,14.46) v1(9.27,44.57) v1(10.84,24.45) v1(10.95,43.8) v1(12.08,48.74) v1(12.19,46.97) v1(12.63,18.22) v1(13.46,52.8) v1(21.07,55.46) v1(21.29,5.07) v1(24.04,4.93) v1(25.13,4.93) v1(27,5.02) v1(27.89,57.69) v1(29.63,4.93) v1(31.52,57.1) v1(36.53,59.67) v1(38.19,59.77) v1(40.21,10.65) v1(40.21,9.99) v1(40.21,9.25) v1(40.3,7.33) v1(40.3,6.45) v1(40.84,10.27) v1(40.84,9.63) v1(40.78,8.37) v1(40.97,6.88) v1(41.42,9.99) v1(41.56,8.37) v1(41.73,9) v1(41.99,10.4) v1(41.99,6.88) v1(42.38,9.14) v1(42.38,8.37) v1(42.69,10.78) v1(43,6.88) v1(43.26,9.89) v1(43.26,9.14) v1(43.26,8.37) v1(43.77,7.24) v1(43.77,6.6) v1(43.77,5.95) v1(44.05,10.12) v1(44.05,9.48) v1(44.05,8.76) v1(44.42,7.22) v1(44.42,6.59) v1(44.42,5.95) v1(44.91,9.51) v1(44.91,8.76) v1(45.04,10.78) v1(45.04,7.22) v1(45.04,6.59) v1(45.04,5.95) v1(53.39,22.73) v1(54.81,37.26) v1(54.81,31.68) v1(54.99,20.98) v1(56.72,35.5) v1(56.85,24.37) v1(58.03,20.56) v1(59,18.52) v1(59.26,21.58) v1(70.45,41.06) v1(71.63,23.83) v1(72.03,18.11) v1(72.44,45.19) v1(72.44,35.03) v1(76.18,29.08) v1(77.52,50.27) v1(77.52,40.11) v1(78.77,9.72) v1(82.6,55.35) v1(82.6,50.27) v1(86.67,9.41) v1(88.25,5.86) v1(92.21,57.9) v1(95.78,9.62) v1(95.88,11.88) v1(100.45,11.71) v1(101.75,10.4) v1(103.71,9.09) v1(106.31,56.5) v1(106.61,54.39) v1(107.74,8.47) v1(107.87,6.89) v1(108.43,9.68) v1(108.85,6.89) v1(109.1,9.75) v1(109.38,10.45) v1(109.53,9.14) v1(109.51,8.41) v1(109.85,6.93) v1(109.96,10.9) v1(110,10.05) v1(110.22,9.08) v1(110.26,8.41) v1(110.54,9.64) v1(110.67,10.35) v1(110.77,56.3) v1(110.85,7.41) v1(111.02,9.09) v1(111.02,8.41) v1(111.14,9.88) v1(111.55,7.43) v1(111.63,9.39) v1(111.75,8.5) v1(111.74,6.18) v1(113.08,14.71) v1(115.49,7.35) v1(115.66,10.6) v1(116.23,14.72) v1(116.57,17.33) v1(117.23,16.1) v1(118.16,55.35) v1(118.33,46.61) v1(120.34,51.5) v1(121.61,48.3) v1(123.24,45.19) v1(123.24,29.95) v1(123.24,24.87) v1(123.4,50.09) v1(128.32,35.03) v1(137.25,38.11) v1(139.48,24.68) v1(139.48,19.6) v1(142.59,30.63) v1(144.56,55.16) v1(144.56,50.08) v1(144.56,45) v1(144.56,24.68) v1(149.64,55.16) v1(149.64,50.08) v1(153.76,5.3) v1(154.72,60.24) v1(154.72,55.16) v1(159.8,60.24) v1(159.8,55.16) v1(164.88,60.24) v1(164.88,55.16) v1(167.31,6.61) v1(168.03,11.69) v1(169.09,10.42) v1(169.09,6.61) v1(169.47,4.96) v1(169.96,60.24) v1(169.96,55.16) v1(171.19,9.15) v1(171.5,6.1) v1(171.5,4.96) v1(174.74,10.04) v1(174.74,9.21) v1(174.72,8.52) v1(174.72,7.72) v1(174.97,6.9) v1(175.04,60.24) v1(175.04,55.16) v1(175.49,10.04) v1(175.56,7.72) v1(175.62,9.21) v1(175.58,8.52) v1(175.99,6.9) v1(176.21,10.04) v1(176.26,7.72) v1(176.31,9.21) v1(176.32,8.52) v1(177.07,10.04) v1(177,6.9) v1(177.13,9.15) v1(177.08,8.52) v1(177.08,7.72) v1(177.82,10.04) v1(177.84,9.15) v1(177.8,8.41) v1(177.84,7.72) v1(177.82,6.9) v1(178.53,10.04) v1(178.58,9.15) v1(178.58,8.41) v1(178.58,7.72) v1(178.58,6.9) v1(180.12,50.08) v1(181.9,10.71) v1(185.2,55.16) v1(185.2,50.08) v1(185.2,45) v1(189.19,25.63) v1(189.32,30.27) v1(190.28,50.08) v1(190.28,45) v1(190.28,39.92) v1(190.28,34.84) v1(190.34,30.27) v1(190.28,14.52) v1(190.85,15.6) v1(195.23,39.79) v1(195.36,24.68) v1(195.41,35.19) v2(21.54,7.74) v2(23.04,7.06) v2(27.13,7.7) v2(28.63,7.07) v2(35.22,10.4) v2(36.81,9.13) v2(42.87,4.66) v2(109.82,5.03) v3(72.45,38.6) v3(72.45,37.35) v3(74.66,37.35) v3(90.06,6.97) v3(95.65,6.84) v3(119.02,48.37) v3(119.52,47.86) v3(125.12,24.37) v3(125.79,24.77) v3(155.54,7.25) v3(157.05,7.88) v3(161.16,7.25) v3(162.65,7.88) v3(177.13,5.34)
VBAT: length 116.5
  Top Layer w0.254: R16.1 60.53,26.4 v1(58.5,24.37) ; C7.2 C56.2 ; 56.72,36.34 57.02,36.64 v1(57.02,37.32) 51.43,42.24 arc(46.24,49.03) 38.85,53.33 33.27,58.91 32.21,58.91 31.4,59.18 27.55,60.29 R8.2 ; L2.2 U9.3
  Inner3 w0.254: v1(57.02,37.32) 57.2,35.74 arc(57.25,35.56) 57.24,35.38 v1(58.5,24.37)
  Inner4 w0.127: v2(21.04,7.03) 22.65,7.05 arc(23.05,6.67) 23.44,7.05 v2(26.63,7.09) 27.02,7.33 arc(27.34,7.37) 27.52,7.64 30.93,9.78 35.42,10.02 36.71,10.02 arc(37.06,10.09) 37.2,10.42 38.61,11.57 39.45,11.57 40.54,11.16 arc(40.66,11.11) 40.78,11.07 arc(40.86,11.07) 40.93,11.07 41.48,11.06 42.06,11.06 42.09,11.09 arc(42.13,11.11) 42.16,11.12 43.46,11.56 arc(43.47,11.56) 43.47,11.56 arc(43.6,11.59) 43.73,11.64 arc(43.92,11.82) 44.01,12.07 45.02,14.77 arc(48.45,17.97) 51.12,21.81 54.41,24.47 arc(54.81,24.52) 55.03,24.86 v1(55.94,25.43)
  Bottom Layer w0.254: 28.02,9.89 v1(27.13,9.89) 26.78,7.93 arc(26.72,7.78) 26.73,7.61 v2(26.63,7.09) ; v1(24.08,9.98) v1(23.06,9.98) 21.03,8.24 v2(21.04,7.03)
  vias: v1(28.15,9.98)
VBUS_5V: length 24.5
  Top Layer w0.254: v1(10.25,45.4) LED5.1
  Inner3 w0.254: v1(9.66,40.33) 9.79,41.41 arc(10.78,42.07) 10.2,43.11 9.99,43.18 v1(10.25,45.4) 10.6,49.79 arc(11.05,50.59) 10.73,51.44 v1(11,54.72)
  Inner4 w0.254: v1(9.66,40.33) 9.28,39.2 arc(9.55,38.96) 9.56,38.59 arc(9.95,38.29) 9.83,37.8 arc(9.83,37.74) 9.83,37.68 arc(9.38,37.01) 8.57,37.06 v1(8.14,35.78)
ACCEL1_INT:
  vias: v2(113.34,6.21)
ACCEL2_INT: length 45.7
  Inner4 w0.254: 117.74,48.08 116.7,47.05 116.7,46.44 arc(116.7,46.42) 116.71,46.39 arc(121.41,33.53) 117.98,20.27 ; 112.73,6.7 112.73,6.74 113.78,7.79 113.78,8.45 113.85,8.52 113.85,8.91 113.78,8.97 113.78,13.85 117.97,18.04 ; 117.97,18.05 117.97,20.24
  vias: v1(117.76,48.18) v2(112.7,6.71)
BOOT0: length 41.2
  Top Layer w0.127: 38.31,10.31 38.34,11.2 38.71,11.49 ; 38.72,11.47 39.48,11.47 arc(39.5,11.47) 39.53,11.47 39.87,11.81 ; v1(16.71,7.09) 22.29,6.3 22.87,5.86 22.94,5.79 32.89,5.79 32.89,5.82 arc(32.95,5.97) 33.11,6.03 34.09,6.03 35.65,7.59 arc(35.64,8.11) 36.08,8.37 36.42,8.37 36.67,8.62 37.54,8.62 arc(38.04,9.06) 37.67,9.62 38.32,10.26
  Top Layer w0.254: 116.99,14.17 117.45,14.17 117.74,14.46 ; 17.24,6.31 SW1.4 ; v1(115.39,14.28) 115.67,13.99 116.68,13.99
  Inner3 w0.127: 106.76,11.68 106.77,11.69 107,11.91 ; v1(115.39,14.28) 115.13,14.28 114.2,15.2 112.88,15.2 arc(112.87,15.21) 112.87,15.21 arc(110.8,13.72) 108.57,12.48 arc(108.56,12.48) 108.55,12.47 arc(107.78,12.16) 106.98,11.97 arc(106.98,11.94) 106.98,11.91
  vias: v2(106.73,11.59) v3(174.13,12.06)
CANFD_RX: length 30.6
  Inner3 w0.127: v2(46.07,9.12) 45.48,9.7 45.38,9.7 45.1,9.98 45.08,9.98 43.39,11.67 42.41,11.67 42.02,11.27 40.73,11.27 40.34,11.67 v2(36.81,11.67)
  Inner4 w0.254: v3(180.05,9.28) 180.05,10.42 179.54,10.93 174.46,10.93 173.7,11.69 v1(171.92,11.69)
  Bottom Layer w0.254: 112.64,9.21 109.79,12.06 108.06,12.06 108.04,12.04 106.54,12.04 106.19,11.7 103.8,11.7
  vias: v1(103.64,11.66) v2(112.69,9.2)
CANFD_TX: length 30.9
  Inner3 w0.127: v2(45.7,8.61) 44.94,7.86 v2(36.81,7.86)
  Inner4 w0.254: v1(171.87,7.88) 173.9,5.85 179.67,5.85 179.85,6.03 179.85,7.96 v3(180.66,8.77)
  Bottom Layer w0.254: 113.32,8.68 112.56,7.92 103.9,7.92
  vias: v1(103.75,7.79) v2(113.38,8.71)
CANH: length 53.9
  Top Layer w0.254: 95.24,6.56 95.24,6.61 ; 95.2,6.65 95.2,7.07 95.16,7.1 ; v2(31.67,9.13) 29.05,7.8 arc(28.95,7.95) 28.78,8.01 28.48,8.01 arc(28.29,7.93) 28.2,7.73 28.2,7.36 FPC1.5 28.02,6.33 27.64,6.08 23.06,6.08 22.56,6.46 FPC2.5 ; 89.59,7.16 89.59,5.86
  Inner3 w0.254: v1(19.49,12.95) 20.24,11.61 20.5,10.06 arc(20.51,9.93) 20.55,9.81 arc(20.67,9.64) 20.85,9.52 22.02,8.42 v2(22.54,7.47)
  Inner4 w0.254: 95.22,6.41 95.44,6.41 95.46,6.38 95.84,6.38 96.11,6.65 96.11,7.29 97.91,9.09 98.61,9.09 ; v3(156.56,6.99) 156.93,7.44 arc(157.4,7.59) 157.46,8.09 157.84,8.55 158.21,8.92 158.21,9.33 ; 89.69,5.86 89.94,5.62 92.67,5.62 93.24,5.04 94.29,5.04 95.2,5.95 95.2,6.44 ; 90.48,10.32 91.45,10.32 94.5,7.28 94.82,7.28 95.09,7.01 95.09,6.68 95.19,6.59 ; v3(162.14,7.12) 162.14,8.02 161.83,8.34 161.2,8.34 160.74,8.79 v1(159.38,10.42) 159.1,10.42 158.21,9.53 158.21,9.33 ; 158.21,9.33 arc(158.21,9.32) 158.21,9.3
  Bottom Layer w0.254: v1(166.72,9.15) 165.87,8.3 165.87,7.67 165.32,7.12 v3(162.14,7.12)
  vias: v1(90.38,10.44) v1(98.62,9.18) v3(89.56,5.84) v3(95.22,6.48)
CANL: length 47.7
  Top Layer w0.254: v1(165.32,10.42) 164.51,9.61 v1(163.54,9.61) ; 26.1,8.18 28.25,8.32 arc(28.37,8.35) 28.48,8.36 28.93,8.36 28.95,8.34 arc(28.96,8.34) 28.96,8.34 30.55,9.55 arc(30.6,9.58) 30.64,9.61 v2(31.67,10.4) ; 26.1,8.18 23.2,8.01 22.9,8.01 arc(22.84,8) 22.79,7.99 arc(22.75,8) 22.7,8.01 22.4,8.01 arc(22.2,7.93) 22.12,7.73 22.12,7.34 FPC2.4 21.97,7.41 21.97,7.73 arc(21.97,7.79) 21.95,7.84 arc(21.73,8.11) 21.38,8.12 v1(19.01,10.97) ; 26.1,8.18 arc(26.31,8.14) 26.47,8.01 arc(26.48,8.01) 26.48,8.01 26.78,8.01 arc(26.79,8.01) 26.79,8.01 arc(27.17,8.16) 27.51,7.95 27.91,8 arc(27.76,7.9) 27.7,7.73 27.7,7.38 FPC1.4 ; 26.1,8.18 arc(26.09,8.18) 26.07,8.18 ; 96.91,10.89 97.37,10.43 97.94,10.43
  Inner4 w0.254: 94.57,6.76 94.53,6.8 94.29,6.8 93.84,6.35 90.04,6.35 89.59,6.8 89.02,6.8
  Bottom Layer w0.254: 98.68,10.4 98.14,10.4 ; v3(156.04,7.88) 156.41,7.88 156.86,8.34 160.78,8.34 161.24,7.88 v3(161.64,7.88) 163.41,9.66 163.54,9.66 ; 98.13,10.42 97.78,10.42 95.78,8.43 92.46,8.43 91.9,7.87 90.04,7.87 89.04,6.87
  vias: v1(98.59,10.4) v3(89.04,6.82) v3(94.64,6.82)
CH340C_RX: length 35
  Inner4 w0.127: v1(11.89,20.81) 13.32,20.43 arc(17.13,16.04) 21.97,12.79 arc(23.09,12.39) 24.27,12.26 39.16,12.26 ; v2(43.4,12.17) 41.73,12.94 41.68,12.95 arc(41.53,12.87) 41.37,12.79 arc(40.3,12.4) 39.16,12.26
CH340C_TX: length 32.6
  Inner4 w0.127: v1(12.52,19.54) 13.89,19.22 arc(17.49,15.43) 21.87,12.59 arc(23.04,12.17) 24.27,12.03 39.26,12.03 39.26,12.03 arc(40.28,12.17) 41.26,12.49 41.65,12.39 41.86,12.09 v2(41.86,11.67)
CHARGEOUT: length 136.5
  Top Layer w0.254: 76.24,10.98 76.24,10.98 ; 76.34,10.89 80.42,10.89 81.37,9.94 81.37,8.38 81.94,7.8 83.46,7.8 84.41,7.83 84.44,7.8 85.25,7.8 85.82,8.38 85.82,10.2 85.88,10.26 85.88,14.57 arc(81.3,18.96) 78.16,24.48 ; 72.81,23.24 73.72,24.15 ; 67.74,27.4 67.74,27.68 68.69,28.63 73.68,28.63 ; 73.76,24.17 arc(75.94,24.24) 78.11,24.46 ; v1(76.25,10.99) arc(76.22,11.14) 76.14,11.26 73.28,14.12 arc(71.25,17.34) 69.62,20.79 arc(68.52,24.01) 67.78,27.34
  Inner4 w0.254: v2(111.82,4.61) 111.61,4.4 85.12,4.4 arc(85.04,4.43) 84.96,4.46 arc(84.71,4.57) 84.45,4.68 arc(81.09,6.67) 78.01,9.06 77.52,9.55 arc(77.46,9.6) 77.4,9.67 77.34,9.67 76.72,10.28 ; 76.18,10.95 76.18,10.81 arc(76.45,10.53) 76.73,10.25
  Bottom Layer w0.254: 72.81,23.24 73.72,24.15 ; 76.34,10.89 80.42,10.89 81.37,9.94 81.37,8.38 81.94,7.8 83.46,7.8 84.41,7.83 84.44,7.8 85.25,7.8 85.82,8.38 85.82,10.2 85.88,10.26 85.88,14.57 arc(81.3,18.96) 78.16,24.48 ; 73.76,24.17 arc(75.94,24.24) 78.11,24.46
  vias: v1(72.9,23.24) v1(73.72,28.71)
FLASH_CS: length 10.9
  Inner4 w0.127: v2(46.37,5.61) 46.37,7.63 46.03,7.97 46.03,8.26 46.65,8.88 46.65,12.27 v1(49.35,14.97)
GEIGER_OUT: length 25.6
  Inner3 w0.254: v1(188.4,26.19) 186.03,23.82 186.03,20.61 178.85,13.43 178.85,13 179.13,12.73 v3(179.13,4.69)
HV_MONITOR: length 73.2
  Top Layer w0.254: R17.1 141.82,34.6 141.82,33.84 ; v1(141.82,33.83) R25.2
  Inner4 w0.127: v3(179.63,5.33) 178.69,5.33 178.31,4.95 177.98,4.95 177.76,5.18 177.52,5.18 177.29,4.95 176.97,4.95 176.74,5.18 176.51,5.18 176.28,4.95 175.95,4.95 175.72,5.18 173.76,5.18 172.94,4.36 152.37,4.36 arc(152.17,4.36) 151.98,4.37 arc(140.64,13.72) 134.81,27.22 arc(134.83,27.27) 134.84,27.31 134.84,30.74 137.89,33.79 141.78,33.79 v1(141.82,33.83)
HV_PWM: length 38.2
  Inner3 w0.254: v1(143.56,18.55) 144.32,17.8 144.32,17.77 150.95,11.14 174.81,11.14 176,12.33 v3(178.15,12.33)
I2C_SCL: length 107.9
  Inner3 w0.127: 105.8,7.27 105.8,12.17 105.89,12.26 106.22,12.26 106.22,12.26 arc(107.33,12.41) 108.38,12.79 arc(115.22,18.06) 119.51,25.55 119.6,25.62 ; v1(74.66,41.1) 74.93,40.82 78.07,40.82 78.25,41 arc(78.39,41.2) 78.52,41.41 arc(81.57,46.38) 85.81,50.38 arc(85.95,50.48) 86.08,50.58 arc(100.41,54.46) 113.95,48.37 113.96,48.37 ; v3(119.03,49.95) 118.7,49.95 arc(118.52,49.92) 118.34,49.95 115.28,49.95 113.96,48.62 113.96,48.37 ; 113.96,48.37 114.14,48.19 arc(117.07,44.62) 119.19,40.52 arc(120.69,33.11) 119.6,25.62 ; 119.61,25.63 119.6,25.62 ; 119.61,25.63 119.6,25.61 arc(119.68,25.54) 119.75,25.46 121.24,23.97 v3(124.44,23.97) ; 119.61,25.63 119.62,25.63
  vias: v2(105.8,7.2)
I2C_SDA: length 156
  Inner3 w0.127: 106.02,11.71 106.02,7.55 106.21,7.37 106.21,6.97 v2(106.46,6.72) ; v3(124.44,24.77) 125.95,26.27 129.29,26.27 arc(129.87,34.21) 128.43,42.03 arc(126.47,46.77) 123.77,51.12 ; 106.03,11.73 106.35,12.06 106.35,12.08 ; 114.47,15.78 113.27,15.78 arc(110.98,14.04) 108.47,12.63 ; 114.46,15.8 119.81,10.45 120.9,10.45 120.99,10.54 arc(126.22,17.62) 129.27,25.88 129.27,26.26 ; 106.35,12.08 106.35,12.08 ; 106.35,12.08 arc(107.44,12.25) 108.47,12.63 ; 106.35,12.08 arc(106.35,12.08) 106.34,12.08 ; v1(74.66,39.85) 74.18,40.32 68.97,40.32 68.53,40.76 arc(71.24,47.46) 75.4,53.36 77.82,55.77 arc(78.91,56.71) 80.05,57.59 arc(98.67,63.75) 117.29,57.59 arc(120.77,54.6) 123.77,51.12 ; 123.77,51.12 arc(123.24,51.48) 122.7,51.8 arc(120.3,52.02) v3(118.52,50.4)
NCTHERM_ADC: length 96.5
  Inner4 w0.254: 112.33,5.36 111.82,5.36 110.43,6.74 110.43,7.17 110.09,7.51 109.66,7.51 105.41,11.76 105.41,12.02 105.59,12.19 106.07,12.19 arc(107.27,12.33) 108.4,12.74 arc(115.92,46.21) 81.61,46.44 arc(81.51,46.41) 81.44,46.5 81.18,46.23 77.2,46.23
  vias: v2(112.33,5.34)
OSC_IN: length 31.5
  Inner3 w0.127: v2(43.36,5.09) 44.15,5.49 arc(44.44,5.42) 44.73,5.52 arc(45.38,5.54) 45.52,6.18 47.14,7 arc(47.61,7) 47.89,7.38 49.02,7.95 arc(49.31,8.36) 49.81,8.35 v1(50.92,8.91)
  Bottom Layer w0.254: v2(110.33,4.86) 110.36,4.89 110.36,5.53 112,7.18 112.55,7.18 112.56,7.19 113.78,7.19 117.23,10.64 117.23,10.86 117.35,10.98 117.35,11.28 117.23,11.39 117.23,15.4 115.82,16.8 115.39,16.8 ; v1(181.95,7) 180.74,5.78 179.44,5.78 178.36,4.71 v3(177.64,4.71)
  vias: v1(115.47,16.76)
OSC_OUT: length 36.3
  Inner3 w0.127: v2(43.89,4.55) 45.13,4.76 arc(45.36,4.9) 45.62,4.84 46.18,4.94 47.6,5.92 arc(48.11,5.93) 48.31,6.4 52.27,9.13 v1(52.61,10.61)
  Bottom Layer w0.254: 183.99,8.26 183.38,8.26 182.98,8.66 181.85,8.66 179.33,6.14 179.29,6.14 178.49,5.34 v3(178.15,5.34) ; 110.85,5.32 111.65,5.32 112.14,5.81 112.53,5.81 112.59,5.74 113.54,5.74 113.81,6.02 113.81,6.64 117.73,10.56 117.73,17.97 117.4,18.31
  vias: v1(117.38,18.28) v1(184.09,8.3) v2(110.83,5.34)
PIEZOCTRL: length 71
  Top Layer w0.254: 92.41,56.85 91.96,57.3 91.59,57.3 90.12,58.77 90.12,59.74
  Inner4 w0.254: 94.17,54.43 93.91,54.43 92.35,55.99 92.35,56.97 ; 110.79,12.22 110.79,13.68 arc(119.41,40.96) 94.19,54.47
  vias: v1(92.37,56.86) v2(110.83,12.29)
SPI1_MISO: length 8.1
  Top Layer w0.127: 46.81,8.28 46.82,7.69 46.33,7.55 ; 46.8,8.28 47.17,9.56 50.15,12.53 50.15,13.97
SPI1_MOSI: length 14.5
  Inner3 w0.254: v1(56.85,17.12) 53.42,13.69 52.62,13.69 52.31,13.38 52.31,12.84 47.59,8.12 v2(46.38,8.12)
SPI1_SCK: length 18
  Inner4 w0.127: v1(55.67,17.74) 51.44,13.51 51.44,10.57 46.75,5.87 arc(46.64,5.24) 46,5.35 v2(45.42,4.55)
STB: length 36.5
  Inner3 w0.254: 101.54,8.14 98.83,8.14 98.45,7.76 ; v1(166.52,7.88) 166.65,8.01 169.26,8.01 172.03,10.78 174.96,10.78 175.87,11.69 v3(176.62,11.69)
  Bottom Layer w0.127: v2(31.67,7.86) 40.56,11.46 arc(40.54,11.9) 40.95,12.07 arc(41.33,12.47) 41.73,12.09 arc(41.73,12.06) 41.73,12.03 arc(41.86,12.06) 41.98,12.04 v2(42.37,12.19)
  Bottom Layer w0.254: 109.38,11.45 106.27,8.35 101.6,8.35
  vias: v1(98.55,7.75) v1(101.76,8.27) v1(165.36,7.88) v2(109.32,11.58)
SWD_CLK: length 58.3
  Inner4 w0.127: 102.64,5.65 103.06,6.07 110.74,6.09 111.72,5.12 112,5.12 112.17,4.95 112.63,4.95 113.74,6.05 113.74,6.21 114.44,6.91 114.44,9.16 114.39,9.21 114.39,10.24 115.62,11.47 115.62,11.87 115.86,12.12 115.87,12.12 v1(123.24,19.49)
  Inner4 w0.254: J_SWD1.3 35.23,4.4 18.01,4.4 11.41,11 v1(10.56,11)
SWD_IO: length 30.4
  Top Layer w0.127: 40.3,11.93 40.3,12.23 40.5,12.43 40.89,12.55 46.05,12.55 v1(46.18,12.43)
  Inner3 w0.127: 101.81,5.45 102.64,6.28 106.58,6.28 106.87,6.56 106.87,11.11 v2(107.31,11.55)
  Inner4 w0.127: v1(46.18,12.43) 36.11,6.09 arc(35.73,5.98) 35.46,5.68 J_SWD1.2
  vias: v3(174.63,11.59)
U_USB_D+: length 62.5
  Top Layer w0.254: C6.2 7.58,32.07 7.24,32.07 arc(7.04,32.15) 6.96,32.35 6.96,32.86 arc(6.87,32.88) 6.79,32.9 5.89,33.2 5.88,33.22 arc(5.19,34.29) 5.82,35.4 arc(6.07,36.44) 7.11,36.66 7.12,36.66 arc(7.31,36.83) 7.55,36.9 arc(7.55,36.92) 7.56,36.93 arc(7.56,36.98) 7.58,37.03 7.67,37.31 arc(7.81,37.47) 8.02,37.49 ; 8.03,37.49 8.11,37.48 8.47,37.48 8.6,37.35 J_USB1.B6
  Inner3 w0.127: v2(40.87,11.69) 40.84,12.17 40.76,12.3 arc(40.02,12.11) 39.26,12.03 39.26,12.03 24.27,12.03 arc(23.04,12.17) 21.87,12.59 arc(16.35,16.44) 12.24,21.78 10.95,22.84 v1(10.62,22.84) 9.71,23.6 arc(9.59,23.73) 9.53,23.89 arc(9.52,24.03) 9.55,24.17 9.94,27.95 arc(9.72,29.19) 9.56,30.44 v1(7.58,31.48)
  Bottom Layer w0.254: v2(9.52,38.14) 9.43,37.82 arc(9.42,37.62) 9.31,37.44 v1(7.58,31.48)
  vias: v1(9.58,22.3)
U_USB_D-: length 65.1
  Top Layer w0.254: C51.2 7.55,30.93 7.28,30.93 arc(7.08,31.01) 7,31.21 7,31.75 arc(7,31.75) 7,31.76 arc(6.71,31.99) 6.6,32.35 6.6,32.59 5.64,32.91 5.62,32.96 arc(4.84,34.21) 5.42,35.56 arc(5.84,36.71) 7.01,37.06 arc(7.13,37.14) 7.26,37.2 7.38,37.56 7.41,37.58 arc(7.59,37.75) 7.82,37.85 7.82,37.86 7.85,37.86 7.91,37.92 7.92,37.91 arc(8.05,37.97) 8.18,37.96 8.57,37.83 J_USB1.A7
  Inner3 w0.127: 39.16,12.26 24.27,12.26 arc(23.09,12.39) 21.97,12.79 arc(16.32,16.79) 12.2,22.34 v1(9.98,23.98) 10.22,27.74 arc(9.67,32.72) 10.24,37.7 9.98,38.34 9.55,38.77 v2(9.14,38.77) ; v2(41.34,12.08) 41.35,12.55 41.2,12.71 arc(40.2,12.38) 39.16,12.26
  Inner4 w0.254: v2(9.14,38.77) 9.08,38.26 arc(9.07,38.19) 9.06,38.12 v2(9.02,37.73)
  vias: v1(8.95,23.44)
$1N887: length 56.7
  Top Layer w0.254: 13.81,51.51 C40.1 v1(21.55,53.62) ; J_BAT2.2 13.43,51.43 arc(13.64,51.4) 13.81,51.51 ; C_VBAT1.1 J_BAT3.2
  Inner3 w0.254: J_BAT3.2 53.71,50.02 arc(54.01,50.23) 54.35,50.33 arc(54.81,50.28) 55.2,50.04 arc(55.36,49.86) 55.47,49.65 55.82,49.14 55.87,48.25 J_BAT1.2 ; v3(27.89,55.23) 21.54,53.7
  Bottom Layer w0.254: v3(27.89,55.23) 30.18,55.31 30.31,55.63 30.45,55.63 arc(30.64,55.71) 30.73,55.9 30.73,56.4 arc(30.72,56.47) 30.7,56.53 J_BAT3.2
$1N890: length 2.9
  Top Layer w0.254: U6.2 23.68,56.14
$1N891: length 11
  Top Layer w0.254: C40.2 27.68,54.86 arc(27.96,54.81) 28.21,54.94 28.27,54.94 arc(28.45,55.01) 28.54,55.19 R10.1 28.45,55.71 arc(28.37,55.76) 28.27,55.78 28.19,55.78 U6.5
$1N894: length 8.3
  Top Layer w0.254: LED5.2 7.04,46.03 7.17,46.4 arc(7.31,46.56) 7.52,46.57 8.47,46.25 arc(8.63,46.1) 8.64,45.89 8.63,45.86 9.85,45.77 10.07,46.17 arc(10.24,46.3) 10.45,46.28 10.88,46.04 arc(11.01,45.88) 10.99,45.66 10.96,45.61 v1(12.44,45.46)
$1N895:
  vias: v1(12.86,46.21)
$1N897: length 0.9
  Top Layer w0.254: R9.2 U2.5
$1N898: length 2.7
  Top Layer w0.254: U6.3 Q_BMS1.4
$1N900: length 68.3
  Top Layer w0.254: 11.36,47.42 J_BAT2.1 ; C38.2 32.65,62.28 32.65,62.48 arc(32.57,62.68) 32.37,62.76 31.87,62.76 arc(31.67,62.68) 31.59,62.48 31.59,62.23 C_VBAT1.2 J_BAT3.1
  Inner3 w0.254: 54.47,49.25 32.75,59.88 arc(32.1,59.97) 31.63,60.43 J_BAT3.1 ; 25.69,59.56 21.28,55.95 arc(20.73,55.87) 20.55,55.35 12.6,48.86 arc(12.42,48.33) 11.87,48.26 v1(11.55,48)
  Inner4 w0.254: v1(31.3,55.48) 31.14,56.73 arc(30.99,57.03) 31.05,57.36 J_BAT3.1
  Bottom Layer w0.254: 25.69,59.56 30.18,58.2 J_BAT3.1
$1N2732: length 1.6
  Top Layer w0.254: R32.2 162.58,11.44 162.38,11.44
$1N2784: length 9.7
  Top Layer w0.254: D4.2 143.15,15.48 Q2.1 147.92,16.09 L3.2
$1N3117: length 3.3
  Top Layer w0.254: U3.3 190.72,24.3 C3.2
$1N3156: length 7.7
  Top Layer w0.254: J_USB1.B5 8.16,36.39 7.71,36.54 arc(7.49,36.52) 7.35,36.36 7.34,36.32 7.06,36.3 arc(6.23,36.06) 6.36,35.2 arc(5.55,34.44) 6.14,33.49 6.9,33.24 arc(7.17,33.2) 7.44,33.24 R13.2
$1N3842: length 1.8
  Top Layer w0.254: Q2.2 143.47,19.31 143.13,19.31
$1N4040: length 10.1
  Top Layer w0.254: U3.4 191.84,27.51 191.84,31.31 193.23,32.7 193.23,35.19 ; 193.23,35.19 193.9,35.19 ; 193.23,35.19 R4.2
$1N4044: length 9.9
  Top Layer w0.254: 185.18,13.9 185.55,13.53 186.63,13.53 190.85,17.75 ; 190.85,17.75 190.85,18.73 C3.1 ; 190.85,17.75 R30.2
$1N4167: length 85.3
  Bottom Layer w0.254: v1(140.58,43.97) 146.67,43.97 146.91,44.2 arc(147.02,44.32) 147.14,44.43 arc(178.5,50.44) 182.91,18.81 182.91,17.09 184.85,15.15 arc(185.18,13.9) 186.42,13.58
$1N5814: length 3.6
  Top Layer w0.254: 74.4,22.31 74.07,22.65 73.69,22.65 72.83,21.78 72.47,21.78 ; 74.6,22.22 arc(75.19,22.15) 75.75,21.95
$1N5980: length 7.6
  Top Layer w0.254: 73.01,21.05 72.78,21.05 72.72,20.99 72.41,20.99 71.89,21.51 71.89,21.52 69.75,23.66 69.75,23.7 69.69,25.44 69.84,25.59 ; 69.92,25.59 69.92,25.76 ; 73.14,20.93 73.14,20.07 72.98,19.91
$1N6241: length 1.9
  Top Layer w0.254: 73.85,21.68 74.9,20.62 74.9,20.26
$1N6389: length 5
  Bottom Layer w0.254: 83.59,10.01 83.59,12.78 82,14.38
$1N8915: length 2.6
  Top Layer w0.254: 59.13,22.39 59.13,22.46 U9.1 R_FB1.2
$1N8918: length 2.3
  Top Layer w0.254: U9.2 58.68,23.8 arc(58.72,23.81) 58.75,23.82 60.23,23.82 R16.2
$1N8921: length 1
  Top Layer w0.254: U9.5 56.66,23.8 56.56,23.8 arc(56.43,23.83) 56.34,23.91 L2.1
$1N8925: length 3.5
  Top Layer w0.254: LED6.1 54.92,23.45 arc(55.09,23.19) 55.35,23.04 55.38,23.01 55.41,23.01 R12.1
$1N9534: length 1.3
  Top Layer w0.254: R29.1 LED2.1
$1N9861: length 5
  Top Layer w0.254: v1(105.77,59.54) 105.77,57.99 U17.1
  Bottom Layer w0.254: 103.15,59.64 105.68,59.64 v1(105.77,59.54)
  vias: v1(103.33,59.53)
$1N9877: length 5.8
  Top Layer w0.254: 106.67,55.41 107.55,55.41 107.96,55 109.39,55 110.4,53.99 ; 109.9,52.65 110.3,53.06 110.3,54.01
  vias: v1(106.31,55.55)
$1N10012: length 5.7
  Top Layer w0.254: 98.22,58.92 98.22,56.61 97.8,56.2
  Bottom Layer w0.254: 95.11,58.78 97.57,58.78 J_PIEZO1.2
  vias: v1(94.82,58.9)
$1N11861: length 1
  Top Layer w0.254: R29.2 179.63,11.97
$1N15938: length 2.1
  Top Layer w0.254: 94.02,11.48 94.02,11.48 94.52,10.98 95.94,10.98
$1N19964: length 6.2
  Inner3 w0.254: v1(32.16,63.49) v1(38.18,61.86)
$1N20428: length 1.7
  Top Layer w0.254: 113.34,13.03 115,13.03
$1N20714: length 1.1
  Top Layer w0.254: 92.01,59.82 91.94,59.89 90.89,59.89
$1N22151: length 1.6
  Top Layer w0.254: 29.18,57 28.54,57 U6.6
$1N22590: length 2.4
  Top Layer w0.254: 10.77,21.54 11.18,21.95 11.18,22.66 11.22,22.7 11.22,23.17 11.18,23.21 C47.2
$1N22735: length 15
  Top Layer w0.254: J_USB1.A5 9.29,39.17 8.66,39.38 arc(8.45,39.37) 8.31,39.21 8.21,38.92 arc(8.2,38.87) 8.2,38.82 arc(8.17,38.78) 8.15,38.73 8.05,38.45 arc(8.04,38.4) 8.04,38.35 arc(8.03,38.34) 8.02,38.33 arc(7.93,38.31) 7.84,38.28 7.8,38.28 7.72,38.22 7.68,38.22 7.62,38.16 arc(7.38,38.04) 7.18,37.86 7.09,37.82 6.97,37.45 arc(6.95,37.44) 6.92,37.43 arc(5.62,36.98) 5.06,35.72 arc(4.48,34.14) 5.34,32.71 5.38,32.62 6.25,32.33 arc(6.36,31.9) 6.65,31.55 6.65,31.21 arc(6.74,30.87) 7,30.64 arc(7,30.62) 7,30.6 7,30.06 arc(7.08,29.87) 7.28,29.79 7.74,29.79 R6.2
$1N26596: length 0.9
  Top Layer w0.254: 112.28,12.02 112.43,12.17 112.43,12.84
$1N28064: length 3.3
  Top Layer w0.254: H3.2 R19.2
  vias: v1(15.7,14.21)
$1N32733: length 1.2
  Top Layer w0.254: 50.62,12.4 U12.3
$1N32803: length 1.1
  Top Layer w0.254: U12.7 55.52,19.36

## Copper pours and planes (outline as drawn; the poured copper is in the pictures)
3V3 on 3V3: 0.26,67.94 197.09,67.94 197.09,0.26 0.26,0.26
GND on Top Layer: 45.44,3.97 31.67,64.18 17.91,3.97
GND on Top Layer: 179.44,4 165.67,64.2 151.91,4
